# Altium project STB_LightBoard.PrjPcb (part 4 of 10)

## Sheet LED_String_NE2G757GT.SchDoc: STB Light Board - green String
size A4; Author: flmoll; DrawnBy: flmoll; Organization: PBL; Revision: A; SheetNumber: 18; SheetTotal: 20
Used 6 times, as channels LG/g_10, LG/g_11, LG/g_12, LG/g_13, LG/g_14, LG/g_15. Parts and nets are listed once, with the designators drawn on the sheet.
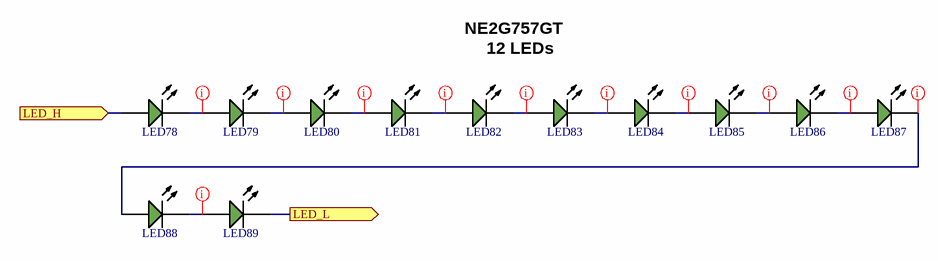
[diagram p5: LED_String_NE2G757GT.SchDoc]

### Parts
LED78  NE2G757GT  [NE2G757GT]  (value not drawn)
LED79  NE2G757GT  [NE2G757GT]  (value not drawn)
LED80  NE2G757GT  [NE2G757GT]  (value not drawn)
LED81  NE2G757GT  [NE2G757GT]  (value not drawn)
LED82  NE2G757GT  [NE2G757GT]  (value not drawn)
LED83  NE2G757GT  [NE2G757GT]  (value not drawn)
LED84  NE2G757GT  [NE2G757GT]  (value not drawn)
LED85  NE2G757GT  [NE2G757GT]  (value not drawn)
LED86  NE2G757GT  [NE2G757GT]  (value not drawn)
LED87  NE2G757GT  [NE2G757GT]  (value not drawn)
LED88  NE2G757GT  [NE2G757GT]  (value not drawn)
LED89  NE2G757GT  [NE2G757GT]  (value not drawn)

### Ports
LED_H (in, see LED_Driver_NE2G757GT[3B]), LED_L (out, see LED_Driver_NE2G757GT[3B])

### Nets
LED_H: LED78.2(A) ; port LED_H
LED_L: LED89.1(K) ; port LED_L
NetLED78_1: LED78.1(K) LED79.2(A)
NetLED79_1: LED79.1(K) LED80.2(A)
NetLED80_1: LED80.1(K) LED81.2(A)
NetLED81_1: LED81.1(K) LED82.2(A)
NetLED82_1: LED82.1(K) LED83.2(A)
NetLED83_1: LED83.1(K) LED84.2(A)
NetLED84_1: LED84.1(K) LED85.2(A)
NetLED85_1: LED85.1(K) LED86.2(A)
NetLED86_1: LED86.1(K) LED87.2(A)
NetLED87_1: LED87.1(K) LED88.2(A)
NetLED88_1: LED88.1(K) LED89.2(A)

### Channels
LG/g_10: designators end in _g_10; ports LED_H=NetC7_D26_2 LED_L=NetLED89_g_10_1
LG/g_11: designators end in _g_11; ports LED_H=NetC7_D26_2 LED_L=NetLED89_g_11_1
LG/g_12: designators end in _g_12; ports LED_H=NetC7_D26_2 LED_L=NetLED89_g_12_1
LG/g_13: designators end in _g_13; ports LED_H=NetC7_D26_2 LED_L=NetLED89_g_13_1
LG/g_14: designators end in _g_14; ports LED_H=NetC7_D26_2 LED_L=NetLED89_g_14_1
LG/g_15: designators end in _g_15; ports LED_H=NetC7_D26_2 LED_L=NetLED89_g_15_1

### Layout directives
net class LED: NetLED78_g_10_1, NetLED79_g_10_1, NetLED80_g_10_1, NetLED81_g_10_1, NetLED82_g_10_1, NetLED83_g_10_1, NetLED84_g_10_1, NetLED85_g_10_1, NetLED86_g_10_1, NetLED87_g_10_1, NetLED88_g_10_1

### Notes on the sheet
- NE2G757GT
- 12 LEDs
- 1
- 2
- 3
- 4
- A
- B
- C
- Project:
- D
- Date:
- Drawing number:
- Rev:
- Format:
- A4 Q
- Drawn by:
- Laboratory:
- Page
- Sheet:
- of
- File:

### Library data of the parts
LED78-LED89 = CMP-02061-1: SMD LED Green 3,5 V, 33 lm 3030 (1212); Manufacturer: Nichia; Optoelectronic Device Type: SINGLE COLOR LED; Vf: 3.5 V; Intensity: 33 lm; REACH SVHC: No SVHC; RoHS Compliant: Yes; Color: Green; Manufacturer Part Number: NE2G757GT

## Sheet LED_Driver_QBHP686.SchDoc: STB Light Board - 740nm
size A3; Author: mayerph; DrawnBy: mayerph; Organization: PBL; Revision: A; SheetNumber: 2; SheetTotal: 20
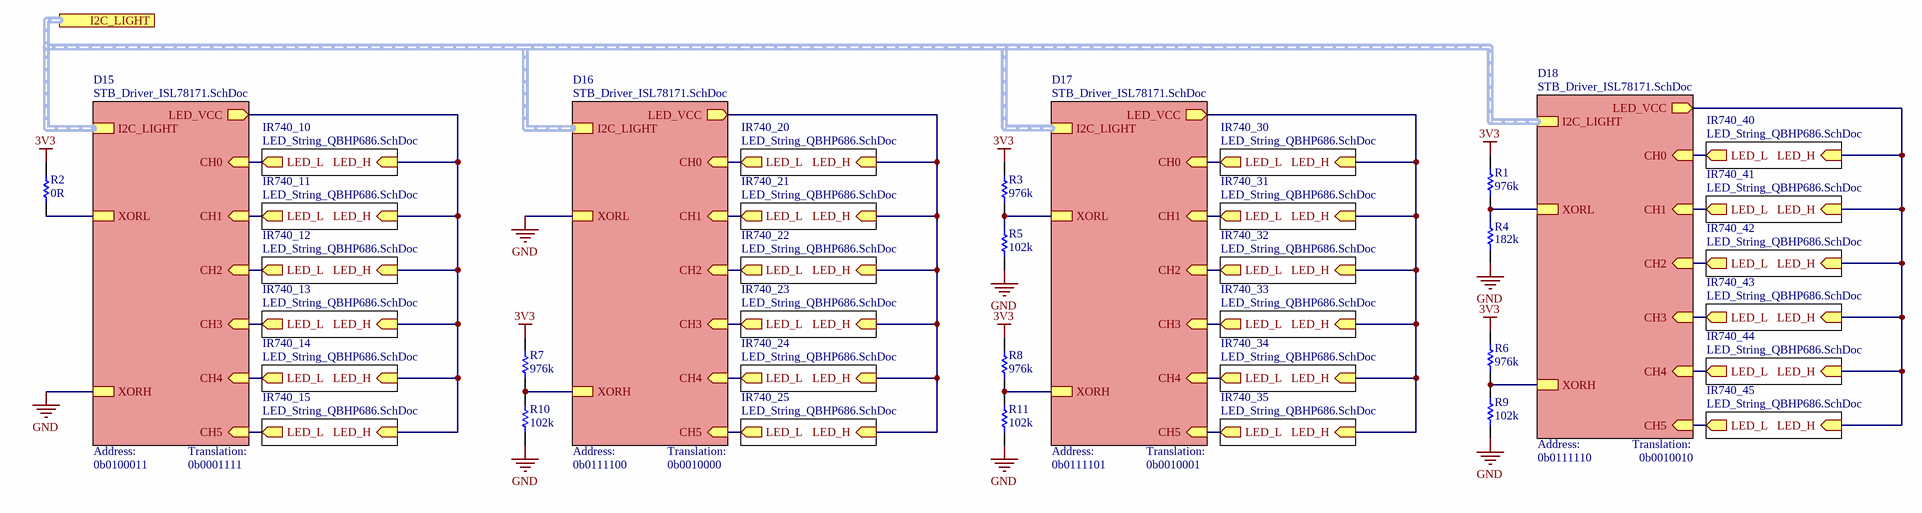
[diagram p6: LED_Driver_QBHP686.SchDoc]

### Parts
R1  976k  [RESC1005X40X25LL05T05]
R2  0R  [RESC1005X40X25LL05T10]
R3  976k  [RESC1005X40X25LL05T05]
R4  182k  [RESC1005X40X25LL05T05]
R5  102k  [RESC1005X40X25LL05T05]
R6  976k  [RESC1005X40X25LL05T05]
R7  976k  [RESC1005X40X25LL05T05]
R8  976k  [RESC1005X40X25LL05T05]
R9  102k  [RESC1005X40X25LL05T05]
R10  102k  [RESC1005X40X25LL05T05]
R11  102k  [RESC1005X40X25LL05T05]

### Sub-sheets
D15 = STB_Driver_ISL78171.SchDoc: CH0 (in), XORL, XORH, LED_VCC (out), CH1 (in), CH2 (in), CH3 (in), CH4 (in), CH5 (in), I2C_LIGHT (harness I2C_LIGHT)
D16 = STB_Driver_ISL78171.SchDoc: CH0 (in), XORL, XORH, LED_VCC (out), CH1 (in), CH2 (in), CH3 (in), CH4 (in), CH5 (in), I2C_LIGHT (harness I2C_LIGHT)
D17 = STB_Driver_ISL78171.SchDoc: CH0 (in), XORL, XORH, LED_VCC (out), CH1 (in), CH2 (in), CH3 (in), CH4 (in), CH5 (in), I2C_LIGHT (harness I2C_LIGHT)
D18 = STB_Driver_ISL78171.SchDoc: CH0 (in), XORL, XORH, LED_VCC (out), CH1 (in), CH2 (in), CH3 (in), CH4 (in), CH5 (in), I2C_LIGHT (harness I2C_LIGHT)
IR740_10 = LED_String_QBHP686.SchDoc: LED_H (in), LED_L (out)
IR740_11 = LED_String_QBHP686.SchDoc: LED_H (in), LED_L (out)
IR740_12 = LED_String_QBHP686.SchDoc: LED_H (in), LED_L (out)
IR740_13 = LED_String_QBHP686.SchDoc: LED_H (in), LED_L (out)
IR740_14 = LED_String_QBHP686.SchDoc: LED_H (in), LED_L (out)
IR740_15 = LED_String_QBHP686.SchDoc: LED_H (in), LED_L (out)
IR740_20 = LED_String_QBHP686.SchDoc: LED_H (in), LED_L (out)
IR740_21 = LED_String_QBHP686.SchDoc: LED_H (in), LED_L (out)
IR740_22 = LED_String_QBHP686.SchDoc: LED_H (in), LED_L (out)
IR740_23 = LED_String_QBHP686.SchDoc: LED_H (in), LED_L (out)
IR740_24 = LED_String_QBHP686.SchDoc: LED_H (in), LED_L (out)
IR740_25 = LED_String_QBHP686.SchDoc: LED_H (in), LED_L (out)
IR740_30 = LED_String_QBHP686.SchDoc: LED_H (in), LED_L (out)
IR740_31 = LED_String_QBHP686.SchDoc: LED_H (in), LED_L (out)
IR740_32 = LED_String_QBHP686.SchDoc: LED_H (in), LED_L (out)
IR740_33 = LED_String_QBHP686.SchDoc: LED_H (in), LED_L (out)
IR740_34 = LED_String_QBHP686.SchDoc: LED_H (in), LED_L (out)
IR740_35 = LED_String_QBHP686.SchDoc: LED_H (in), LED_L (out)
IR740_40 = LED_String_QBHP686.SchDoc: LED_H (in), LED_L (out)
IR740_41 = LED_String_QBHP686.SchDoc: LED_H (in), LED_L (out)
IR740_42 = LED_String_QBHP686.SchDoc: LED_H (in), LED_L (out)
IR740_43 = LED_String_QBHP686.SchDoc: LED_H (in), LED_L (out)
IR740_44 = LED_String_QBHP686.SchDoc: LED_H (in), LED_L (out)
IR740_45 = LED_String_QBHP686.SchDoc: LED_H (in), LED_L (out)

### Ports
I2C_LIGHT (harness I2C_LIGHT, see STB_LightBoard[4C], LED_Driver_AREM-80C0[1A], LED_Driver_AREM-90C0[1A], LED_Driver_NE2B757GT[2B], LED_Driver_NE2G757GT[2B], LED_Driver_NE2R757GT-P6[2B], LED_Driver_NF2L757GT-F1[1A], LED_Driver_NF2W757GT-F1[1A], STB_Driver_ISL78171[1A], STB_FanControl[1A], STB_UID[1A])

### Nets
3V3: R1.2 R2.2 R3.2 R6.2 R7.2 R8.2
GND: R4.1 R5.1 R9.1 R10.1 R11.1 ; sheet D15/XORH, sheet D16/XORL
NetC7_D15_2: sheet D15/LED_VCC, sheet IR740_10/LED_H, sheet IR740_11/LED_H, sheet IR740_12/LED_H, sheet IR740_13/LED_H, sheet IR740_14/LED_H, sheet IR740_15/LED_H
NetC7_D16_2: sheet D16/LED_VCC, sheet IR740_20/LED_H, sheet IR740_21/LED_H, sheet IR740_22/LED_H, sheet IR740_23/LED_H, sheet IR740_24/LED_H, sheet IR740_25/LED_H
NetC7_D17_2: sheet D17/LED_VCC, sheet IR740_30/LED_H, sheet IR740_31/LED_H, sheet IR740_32/LED_H, sheet IR740_33/LED_H, sheet IR740_34/LED_H, sheet IR740_35/LED_H
NetC7_D18_2: sheet D18/LED_VCC, sheet IR740_40/LED_H, sheet IR740_41/LED_H, sheet IR740_42/LED_H, sheet IR740_43/LED_H, sheet IR740_44/LED_H, sheet IR740_45/LED_H
NetLED64_IR740_10_1: sheet D15/CH0, sheet IR740_10/LED_L
NetLED64_IR740_11_1: sheet D15/CH1, sheet IR740_11/LED_L
NetLED64_IR740_12_1: sheet D15/CH2, sheet IR740_12/LED_L
NetLED64_IR740_13_1: sheet D15/CH3, sheet IR740_13/LED_L
NetLED64_IR740_14_1: sheet D15/CH4, sheet IR740_14/LED_L
NetLED64_IR740_15_1: sheet D15/CH5, sheet IR740_15/LED_L
NetLED64_IR740_20_1: sheet D16/CH0, sheet IR740_20/LED_L
NetLED64_IR740_21_1: sheet D16/CH1, sheet IR740_21/LED_L
NetLED64_IR740_22_1: sheet D16/CH2, sheet IR740_22/LED_L
NetLED64_IR740_23_1: sheet D16/CH3, sheet IR740_23/LED_L
NetLED64_IR740_24_1: sheet D16/CH4, sheet IR740_24/LED_L
NetLED64_IR740_25_1: sheet D16/CH5, sheet IR740_25/LED_L
NetLED64_IR740_30_1: sheet D17/CH0, sheet IR740_30/LED_L
NetLED64_IR740_31_1: sheet D17/CH1, sheet IR740_31/LED_L
NetLED64_IR740_32_1: sheet D17/CH2, sheet IR740_32/LED_L
NetLED64_IR740_33_1: sheet D17/CH3, sheet IR740_33/LED_L
NetLED64_IR740_34_1: sheet D17/CH4, sheet IR740_34/LED_L
NetLED64_IR740_35_1: sheet D17/CH5, sheet IR740_35/LED_L
NetLED64_IR740_40_1: sheet D18/CH0, sheet IR740_40/LED_L
NetLED64_IR740_41_1: sheet D18/CH1, sheet IR740_41/LED_L
NetLED64_IR740_42_1: sheet D18/CH2, sheet IR740_42/LED_L
NetLED64_IR740_43_1: sheet D18/CH3, sheet IR740_43/LED_L
NetLED64_IR740_44_1: sheet D18/CH4, sheet IR740_44/LED_L
NetLED64_IR740_45_1: sheet D18/CH5, sheet IR740_45/LED_L
NetR1_1: R1.1 R4.2 ; sheet D18/XORL
NetR2_1: R2.1 ; sheet D15/XORL
NetR3_1: R3.1 R5.2 ; sheet D17/XORL
NetR6_1: R6.1 R9.2 ; sheet D18/XORH
NetR7_1: R7.1 R10.2 ; sheet D16/XORH
NetR8_1: R8.1 R11.2 ; sheet D17/XORH

### Buses and harness runs
harness port I2C_LIGHT = sheet D15/I2C_LIGHT = sheet D16/I2C_LIGHT = sheet D17/I2C_LIGHT = sheet D18/I2C_LIGHT

### Notes on the sheet
- 0b0100011
- Address:
- Translation:
- 0b0001111
- (near R10) Address:
- 0b0111100
- 0b0010000
- (near R11) Address:
- 0b0111101
- 0b0010001
- (near R9) Address:
- 0b0111110
- 0b0010010
- 1
- 2
- 3
- 4
- 5
- 6
- 7
- 8
- A
- B
- C
- D
- Project:
- Date:
- Drawing number:
- Rev:
- Format:
- A3
- Drawn by:
- Laboratory:
- Page
- Sheet:
- of
- File:

### Library data of the parts
R1 R3 R6-R8 = CMP-2002-01120-1: as R87 on sheet LED_Driver_NE2G757GT; Supplier 1: Digi-Key; Supplier Part Number 1: P976KLCT-ND; Manufacturer Part Number: ERJ-2RKF9763X; RoHS: Yes; Category: Chip SMD Resistors; Stock 1: 136638; Pricing 1: 1=0.10000, 10=0.03300, 100=0.01330, 1000=0.00599, 2500=0.00520, 5000=0.00429 (USD); Mount: Surface Mount; Number of Pins: 2; Size Code: 0402; Terminal Finish: Nickel; Package Shape: Rectangular; Min Operating Temperature: -55°C; Max Operating Temperature: 155°C; Resistor Type: FIXED RESISTOR; Construction: Rectangular; Package Style: SMTMeter; Packaging: Tape and Reel; Termination: Wraparound; JESD-609 Code: e3; Technology: METAL GLAZE/THICK FILM; Reach SVHC Compliant: Yes; RoHS Compliant: Yes; ComponentLink1URL: https://datasheet.ciiva.com:443/pdfs/VipMasterIC/IC/PANA/PANA-S-A0009889626/PANA-S-A0009889626-1.pdf?src-supplier=IHS+Markit; ComponentLink1Description: https://datasheet.ciiva.com:443/pdfs/VipMasterIC/IC/PANA/PANA-S-A0009889626/PANA-S-A0009889626-1.pdf?src-supplier=IHS+Markit; ComponentLink2URL: https://datasheet.ciiva.com/43467/1678782-43467581.pdf?src-supplier=Farnell; ComponentLink2Description: https://datasheet.ciiva.com/43467/1678782-43467581.pdf?src-supplier=Farnell; ComponentLink3URL: https://datasheet.ciiva.com/46372/1678782-46372911.pdf?src-supplier=Element14; ComponentLink3Description: https://datasheet.ciiva.com/46372/1678782-46372911.pdf?src-supplier=Element14; ComponentLink4URL: https://datasheet.ciiva.com/22668/1678782-22668415.pdf?src-supplier=Element14; ComponentLink4Description: https://datasheet.ciiva.com/22668/1678782-22668415.pdf?src-supplier=Element14; ComponentLink5URL: https://datasheet.ciiva.com/16758/70260748-16758903.pdf?src-supplier=Allied+Electronics; ComponentLink5Description: https://datasheet.ciiva.com/16758/70260748-16758903.pdf?src-supplier=Allied+Electronics; ComponentLink6URL: https://datasheet.ciiva.com/9179/aoa0000ce2-9179357.pdf?src-supplier=Avnet; ComponentLink6Description: https://datasheet.ciiva.com/9179/aoa0000ce2-9179357.pdf?src-supplier=Avnet; ComponentLink7URL: https://datasheet.ciiva.com/30176/aoa0000ce2-30176831.pdf?src-supplier=Onlinecomponents.com; ComponentLink7Description: https://datasheet.ciiva.com/30176/aoa0000ce2-30176831.pdf?src-supplier=Onlinecomponents.com
R2 = CMP-1011-00001-2: Manufacturer: Yageo / Phycomp; Part Number: RC0402JR-070RL; Rated Power Dissipation (P): 62.5mW; Rated Temperature: 70°C; Package Height: 0.35mm; Package Length: 1mm; Package Width: 0.5mm; Supplier 1: Digi-Key; Supplier Part Number 1: 311-0.0JRDKR-ND; Manufacturer Part Number: RC0402JR-070RL; RoHS: Yes; Category: Chip SMD Resistors; Stock 1: 41330354; Pricing 1: 1=0.10000, 10=0.01200, 25=0.00840, 50=0.00640, 100=0.00480, 250=0.00364, 500=0.00290, 1000=0.00214, 5000=0.00154 (USD); Mount: Surface Mount; Number of Pins: 2; Size Code: 0402; Package Shape: Rectangular; Terminal Finish: Nickel; Min Operating Temperature: -55°C; Max Operating Temperature: 155°C; Resistor Type: FIXED RESISTOR; Resistance: 0R; Packaging: Tape and Reel; Technology: METAL GLAZE/THICK FILM; Termination: Wraparound; JESD-609 Code: e3; Construction: Chip; Package Style: SMTMeter; REACH SVHC: Yes; RoHS Compliant: Yes; ComponentLink1URL: https://datasheet.ciiva.com:443/pdfs/VipMasterIC/IC/YAGO/YAGO-S-A0008145938/YAGO-S-A0008145938-1.pdf?src-supplier=IHS+Markit; ComponentLink1Description: https://datasheet.ciiva.com:443/pdfs/VipMasterIC/IC/YAGO/YAGO-S-A0008145938/YAGO-S-A0008145938-1.pdf?src-supplier=IHS+Markit; ComponentLink2URL: https://datasheet.ciiva.com/2452/pyu-rc0402-51-rohs-l-6-2452608.pdf?src-supplier=Digi-Key; ComponentLink2Description: https://datasheet.ciiva.com/2452/pyu-rc0402-51-rohs-l-6-2452608.pdf?src-supplier=Digi-Key; ComponentLink3URL: https://datasheet.ciiva.com/11808/0900766b80c66297-11808195.pdf?src-supplier=RSComponents; ComponentLink3Description: https://datasheet.ciiva.com/11808/0900766b80c66297-11808195.pdf?src-supplier=RSComponents; ComponentLink4URL: https://datasheet.ciiva.com/7983/1018594-7983535.pdf?src-supplier=Element14; ComponentLink4Description: https://datasheet.ciiva.com/7983/1018594-7983535.pdf?src-supplier=Element14; ComponentLink5URL: https://datasheet.ciiva.com/22747/1018594-22747515.pdf?src-supplier=Element14; ComponentLink5Description: https://datasheet.ciiva.com/22747/1018594-22747515.pdf?src-supplier=Element14; ComponentLink6URL: https://datasheet.ciiva.com/2452/pyu-r-int-thick-7-2452609.pdf?src-supplier=Digi-Key; ComponentLink6Description: https://datasheet.ciiva.com/2452/pyu-r-int-thick-7-2452609.pdf?src-supplier=Digi-Key; ComponentLink7URL: https://datasheet.ciiva.com/2452/pyu-r-int-thick-7-2452610.pdf?src-supplier=Digi-Key; ComponentLink7Description: https://datasheet.ciiva.com/2452/pyu-r-int-thick-7-2452610.pdf?src-supplier=Digi-Key; ComponentLink8URL: https://datasheet.ciiva.com/8896/pyu-rc0402-51-rohs-l-6-8896201.pdf?src-supplier=Avnet; ComponentLink8Description: https://datasheet.ciiva.com/8896/pyu-rc0402-51-rohs-l-6-8896201.pdf?src-supplier=Avnet; ComponentLink9URL: https://datasheet.ciiva.com/15189/getdatasheetpartid-326379-15189533.pdf?src-supplier=Verical; ComponentLink9Description: https://datasheet.ciiva.com/15189/getdatasheetpartid-326379-15189533.pdf?src-supplier=Verical
R4 = CMP-2002-08256-1: Manufacturer: Vishay Dale; Part Number: CRCW0402182KFKED; Value: 182 kOhm; Tolerance: 1%; Rated Power Dissipation (P): 63mW; Resistance: 182kR; Temperature Coefficient: 100ppm/°C; Working Voltage: 50V; Rated Temperature: 70°C; Package Height: 0.35mm; Package Length: 1mm; Package Width: 0.5mm; Reference Standard: AEC-Q200; Supplier 1: Digi-Key; Supplier Part Number 1: 541-182KLDKR-ND; Manufacturer Part Number: CRCW0402182KFKED; RoHS: Yes; Category: Chip SMD Resistors; Stock 1: 76709; Pricing 1: 1=0.10000, 10=0.03600, 100=0.01460, 1000=0.00656, 2500=0.00569, 5000=0.00470 (USD); Mount: Surface Mount; Number of Pins: 2; Size Code: 0402; Terminal Finish: Nickel; Package Shape: Rectangular; Min Operating Temperature: -55°C; Max Operating Temperature: 155°C; JESD-609 Code: e3; Resistor Type: FIXED RESISTOR; Construction: Chip; Package Style: SMTMeter; Packaging: Tape and Reel; Technology: METAL GLAZE/THICK FILM; Termination: Wraparound; Reach SVHC Compliant: Yes; RoHS Compliant: Yes; ComponentLink1URL: https://datasheet.ciiva.com:443/pdfs/VipMasterIC/IC/VISH/VISH-S-A0007266705/VISH-S-A0007266705-1.pdf?src-supplier=IHS+Markit; ComponentLink1Description: https://datasheet.ciiva.com:443/pdfs/VipMasterIC/IC/VISH/VISH-S-A0007266705/VISH-S-A0007266705-1.pdf?src-supplier=IHS+Markit; ComponentLink2URL: https://datasheet.ciiva.com/3256/dcrcwe3-3256117.pdf?src-supplier=Avnet; ComponentLink2Description: https://datasheet.ciiva.com/3256/dcrcwe3-3256117.pdf?src-supplier=Avnet; ComponentLink3URL: https://datasheet.ciiva.com/2463/dcrcwe3-2463286.pdf?src-supplier=Digi-Key; ComponentLink3Description: https://datasheet.ciiva.com/2463/dcrcwe3-2463286.pdf?src-supplier=Digi-Key; ComponentLink4URL: https://datasheet.ciiva.com/5545/dcrcwe3-109170-5545910.pdf?src-supplier=Mouser; ComponentLink4Description: https://datasheet.ciiva.com/5545/dcrcwe3-109170-5545910.pdf?src-supplier=Mouser; ComponentLink5URL: https://datasheet.ciiva.com/2463/dcrcwe3-2463287.pdf?src-supplier=Digi-Key; ComponentLink5Description: https://datasheet.ciiva.com/2463/dcrcwe3-2463287.pdf?src-supplier=Digi-Key; ComponentLink6URL: https://datasheet.ciiva.com/7714/1697337-7714183.pdf?src-supplier=Element14; ComponentLink6Description: https://datasheet.ciiva.com/7714/1697337-7714183.pdf?src-supplier=Element14; ComponentLink7URL: https://datasheet.ciiva.com/2463/dcrcwe3-2463288.pdf?src-supplier=Digi-Key; ComponentLink7Description: https://datasheet.ciiva.com/2463/dcrcwe3-2463288.pdf?src-supplier=Digi-Key; ComponentLink8URL: https://datasheet.ciiva.com/16785/70201119-16785993.pdf?src-supplier=Allied+Electronics; ComponentLink8Description: https://datasheet.ciiva.com/16785/70201119-16785993.pdf?src-supplier=Allied+Electronics; ComponentLink9URL: https://datasheet.ciiva.com/7714/1697337-7714365.pdf?src-supplier=Element14; ComponentLink9Description: https://datasheet.ciiva.com/7714/1697337-7714365.pdf?src-supplier=Element14
R5 R9-R11 = CMP-2002-00613-1: as R88 on sheet LED_Driver_NE2G757GT; Supplier 1: Digi-Key; Supplier Part Number 1: P102KLDKR-ND; Manufacturer Part Number: ERJ-2RKF1023X; RoHS: Yes; Category: Chip SMD Resistors; Stock 1: 79400; Pricing 1: 1=0.10000, 10=0.03300, 100=0.01330, 1000=0.00599, 2500=0.00520, 5000=0.00429 (USD); Mount: Surface Mount; Number of Pins: 2; Size Code: 0402; Terminal Finish: Nickel; Package Shape: Rectangular; Min Operating Temperature: -55°C; Max Operating Temperature: 155°C; Resistor Type: FIXED RESISTOR; Construction: Rectangular; Package Style: SMTMeter; Packaging: Tape and Reel; Technology: METAL GLAZE/THICK FILM; Termination: Wraparound; JESD-609 Code: e3; Reach SVHC Compliant: Yes; RoHS Compliant: Yes; ComponentLink1URL: https://datasheet.ciiva.com:443/pdfs/VipMasterIC/IC/PANA/PANA-S-A0009889626/PANA-S-A0009889626-1.pdf?src-supplier=IHS+Markit; ComponentLink1Description: https://datasheet.ciiva.com:443/pdfs/VipMasterIC/IC/PANA/PANA-S-A0009889626/PANA-S-A0009889626-1.pdf?src-supplier=IHS+Markit; ComponentLink2URL: https://datasheet.ciiva.com/43467/1678782-43467481.pdf?src-supplier=Farnell; ComponentLink2Description: https://datasheet.ciiva.com/43467/1678782-43467481.pdf?src-supplier=Farnell; ComponentLink3URL: https://datasheet.ciiva.com/9119/aoa0000ce2-9119242.pdf?src-supplier=Avnet; ComponentLink3Description: https://datasheet.ciiva.com/9119/aoa0000ce2-9119242.pdf?src-supplier=Avnet; ComponentLink4URL: https://datasheet.ciiva.com/16781/70260748-16781503.pdf?src-supplier=Allied+Electronics; ComponentLink4Description: https://datasheet.ciiva.com/16781/70260748-16781503.pdf?src-supplier=Allied+Electronics; ComponentLink5URL: https://datasheet.ciiva.com/22673/1678782-22673487.pdf?src-supplier=Element14; ComponentLink5Description: https://datasheet.ciiva.com/22673/1678782-22673487.pdf?src-supplier=Element14; ComponentLink6URL: https://datasheet.ciiva.com/16763/70260748-16763080.pdf?src-supplier=Allied+Electronics; ComponentLink6Description: https://datasheet.ciiva.com/16763/70260748-16763080.pdf?src-supplier=Allied+Electronics; ComponentLink7URL: https://datasheet.ciiva.com/7712/1678782-7712798.pdf?src-supplier=Element14; ComponentLink7Description: https://datasheet.ciiva.com/7712/1678782-7712798.pdf?src-supplier=Element14; ComponentLink8URL: https://datasheet.ciiva.com/46373/1678782-46373215.pdf?src-supplier=Element14; ComponentLink8Description: https://datasheet.ciiva.com/46373/1678782-46373215.pdf?src-supplier=Element14

## Sheet LED_String_QBHP686.SchDoc: STB Light Board - 470nm String
size A4; Author: flmoll; DrawnBy: flmoll; Organization: PBL; Revision: A; SheetNumber: 3; SheetTotal: 20
Used 24 times, as channels LIR1/IR740_10, LIR1/IR740_11, LIR1/IR740_12, LIR1/IR740_13, LIR1/IR740_14, LIR1/IR740_15, LIR1/IR740_20, LIR1/IR740_21, LIR1/IR740_22, LIR1/IR740_23, LIR1/IR740_24, LIR1/IR740_25, LIR1/IR740_30, LIR1/IR740_31, LIR1/IR740_32, LIR1/IR740_33, LIR1/IR740_34, LIR1/IR740_35, LIR1/IR740_40, LIR1/IR740_41, LIR1/IR740_42, LIR1/IR740_43, LIR1/IR740_44, LIR1/IR740_45. Parts and nets are listed once, with the designators drawn on the sheet.
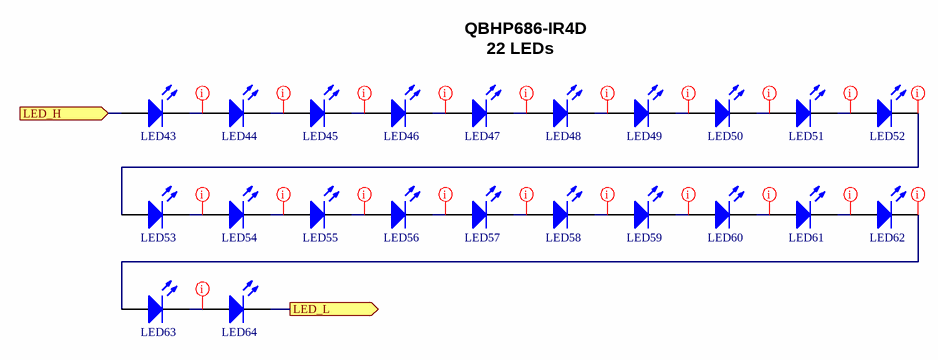
[diagram p7: LED_String_QBHP686.SchDoc]

### Parts
LED43  QBHP686-IR4D  [QBHP686-IR4D]  (value not drawn)
LED44  QBHP686-IR4D  [QBHP686-IR4D]  (value not drawn)
LED45  QBHP686-IR4D  [QBHP686-IR4D]  (value not drawn)
LED46  QBHP686-IR4D  [QBHP686-IR4D]  (value not drawn)
LED47  QBHP686-IR4D  [QBHP686-IR4D]  (value not drawn)
LED48  QBHP686-IR4D  [QBHP686-IR4D]  (value not drawn)
LED49  QBHP686-IR4D  [QBHP686-IR4D]  (value not drawn)
LED50  QBHP686-IR4D  [QBHP686-IR4D]  (value not drawn)
LED51  QBHP686-IR4D  [QBHP686-IR4D]  (value not drawn)
LED52  QBHP686-IR4D  [QBHP686-IR4D]  (value not drawn)
LED53  QBHP686-IR4D  [QBHP686-IR4D]  (value not drawn)
LED54  QBHP686-IR4D  [QBHP686-IR4D]  (value not drawn)
LED55  QBHP686-IR4D  [QBHP686-IR4D]  (value not drawn)
LED56  QBHP686-IR4D  [QBHP686-IR4D]  (value not drawn)
LED57  QBHP686-IR4D  [QBHP686-IR4D]  (value not drawn)
LED58  QBHP686-IR4D  [QBHP686-IR4D]  (value not drawn)
LED59  QBHP686-IR4D  [QBHP686-IR4D]  (value not drawn)
LED60  QBHP686-IR4D  [QBHP686-IR4D]  (value not drawn)
LED61  QBHP686-IR4D  [QBHP686-IR4D]  (value not drawn)
LED62  QBHP686-IR4D  [QBHP686-IR4D]  (value not drawn)
LED63  QBHP686-IR4D  [QBHP686-IR4D]  (value not drawn)
LED64  QBHP686-IR4D  [QBHP686-IR4D]  (value not drawn)

### Ports
LED_H (in, see LED_Driver_QBHP686[2A]), LED_L (out, see LED_Driver_QBHP686[2A])

### Nets
LED_H: LED43.2(A) ; port LED_H
LED_L: LED64.1(K) ; port LED_L
NetLED43_1: LED43.1(K) LED44.2(A)
NetLED44_1: LED44.1(K) LED45.2(A)
NetLED45_1: LED45.1(K) LED46.2(A)
NetLED46_1: LED46.1(K) LED47.2(A)
NetLED47_1: LED47.1(K) LED48.2(A)
NetLED48_1: LED48.1(K) LED49.2(A)
NetLED49_1: LED49.1(K) LED50.2(A)
NetLED50_1: LED50.1(K) LED51.2(A)
NetLED51_1: LED51.1(K) LED52.2(A)
NetLED52_1: LED52.1(K) LED53.2(A)
NetLED53_1: LED53.1(K) LED54.2(A)
NetLED54_1: LED54.1(K) LED55.2(A)
NetLED55_1: LED55.1(K) LED56.2(A)
NetLED56_1: LED56.1(K) LED57.2(A)
NetLED57_1: LED57.1(K) LED58.2(A)
NetLED58_1: LED58.1(K) LED59.2(A)
NetLED59_1: LED59.1(K) LED60.2(A)
NetLED60_1: LED60.1(K) LED61.2(A)
NetLED61_1: LED61.1(K) LED62.2(A)
NetLED62_1: LED62.1(K) LED63.2(A)
NetLED63_1: LED63.1(K) LED64.2(A)

### Channels
LIR1/IR740_10: designators end in _IR740_10; ports LED_H=NetC7_D15_2 LED_L=NetLED64_IR740_10_1
LIR1/IR740_11: designators end in _IR740_11; ports LED_H=NetC7_D15_2 LED_L=NetLED64_IR740_11_1
LIR1/IR740_12: designators end in _IR740_12; ports LED_H=NetC7_D15_2 LED_L=NetLED64_IR740_12_1
LIR1/IR740_13: designators end in _IR740_13; ports LED_H=NetC7_D15_2 LED_L=NetLED64_IR740_13_1
LIR1/IR740_14: designators end in _IR740_14; ports LED_H=NetC7_D15_2 LED_L=NetLED64_IR740_14_1
LIR1/IR740_15: designators end in _IR740_15; ports LED_H=NetC7_D15_2 LED_L=NetLED64_IR740_15_1
LIR1/IR740_20: designators end in _IR740_20; ports LED_H=NetC7_D16_2 LED_L=NetLED64_IR740_20_1
LIR1/IR740_21: designators end in _IR740_21; ports LED_H=NetC7_D16_2 LED_L=NetLED64_IR740_21_1
LIR1/IR740_22: designators end in _IR740_22; ports LED_H=NetC7_D16_2 LED_L=NetLED64_IR740_22_1
LIR1/IR740_23: designators end in _IR740_23; ports LED_H=NetC7_D16_2 LED_L=NetLED64_IR740_23_1
LIR1/IR740_24: designators end in _IR740_24; ports LED_H=NetC7_D16_2 LED_L=NetLED64_IR740_24_1
LIR1/IR740_25: designators end in _IR740_25; ports LED_H=NetC7_D16_2 LED_L=NetLED64_IR740_25_1
LIR1/IR740_30: designators end in _IR740_30; ports LED_H=NetC7_D17_2 LED_L=NetLED64_IR740_30_1
LIR1/IR740_31: designators end in _IR740_31; ports LED_H=NetC7_D17_2 LED_L=NetLED64_IR740_31_1
LIR1/IR740_32: designators end in _IR740_32; ports LED_H=NetC7_D17_2 LED_L=NetLED64_IR740_32_1
LIR1/IR740_33: designators end in _IR740_33; ports LED_H=NetC7_D17_2 LED_L=NetLED64_IR740_33_1
LIR1/IR740_34: designators end in _IR740_34; ports LED_H=NetC7_D17_2 LED_L=NetLED64_IR740_34_1
LIR1/IR740_35: designators end in _IR740_35; ports LED_H=NetC7_D17_2 LED_L=NetLED64_IR740_35_1
LIR1/IR740_40: designators end in _IR740_40; ports LED_H=NetC7_D18_2 LED_L=NetLED64_IR740_40_1
LIR1/IR740_41: designators end in _IR740_41; ports LED_H=NetC7_D18_2 LED_L=NetLED64_IR740_41_1
LIR1/IR740_42: designators end in _IR740_42; ports LED_H=NetC7_D18_2 LED_L=NetLED64_IR740_42_1
LIR1/IR740_43: designators end in _IR740_43; ports LED_H=NetC7_D18_2 LED_L=NetLED64_IR740_43_1
LIR1/IR740_44: designators end in _IR740_44; ports LED_H=NetC7_D18_2 LED_L=NetLED64_IR740_44_1
LIR1/IR740_45: designators end in _IR740_45; ports LED_H=NetC7_D18_2 LED_L=NetLED64_IR740_45_1

### Layout directives
net class LED: NetLED43_IR740_10_1, NetLED44_IR740_10_1, NetLED45_IR740_10_1, NetLED46_IR740_10_1, NetLED47_IR740_10_1, NetLED48_IR740_10_1, NetLED49_IR740_10_1, NetLED50_IR740_10_1, NetLED51_IR740_10_1, NetLED52_IR740_10_1, NetLED53_IR740_10_1, NetLED54_IR740_10_1, NetLED55_IR740_10_1, NetLED56_IR740_10_1, NetLED57_IR740_10_1, NetLED58_IR740_10_1, NetLED59_IR740_10_1, NetLED60_IR740_10_1, NetLED61_IR740_10_1, NetLED62_IR740_10_1, NetLED63_IR740_10_1

### Notes on the sheet
- QBHP686-IR4D
- 22 LEDs
- 1
- 2
- 3
- 4
- A
- B
- C
- Project:
- D
- Date:
- Drawing number:
- Rev:
- Format:
- A4 Q
- Drawn by:
- Laboratory:
- Page
- Sheet:
- of
- File:

### Library data of the parts
LED43-LED64 = CMP-02055-1: Infrared (IR) Emitter 740nm 1.8V 100mA 5.6mW/sr @ 50mA 120° 1411 (3528 Metric); Mfr: QT Brightek (QTB); Manufacturer: QT-Brightek; Series: Mid Power; Type: Infrared (IR); Current - DC Forward (If) (Max): 100mA; Radiant Intensity (Ie) Min @ If: 5.6mW/sr @ 50mA; Wavelength: 740nm; Voltage - Forward (Vf) (Typ): 1.8V; Viewing Angle: 120°; Orientation: Top View; Operating Temperature: -40°C ~ 80°C; Mounting Type: Surface Mount; Package / Case: 1411 (3528 Metric); Base Product Number: QBHP686; Supplier 1: Digi-Key; Supplier Part Number 1: 1516-QBHP686-IR4DCT-ND; Manufacturer Part Number: QBHP686-IR4D; RoHS: No; Stock 1: 1500; Pricing 1: 1=0.92000, 10=0.60000, 100=0.39330, 1000=0.31050 (USD)

## Sheet LED_Driver_AREM-80C0.SchDoc: STB Light Board - 850nm
size A4; Author: flmoll; DrawnBy: flmoll; Organization: PBL; Revision: A; SheetNumber: 13; SheetTotal: 20
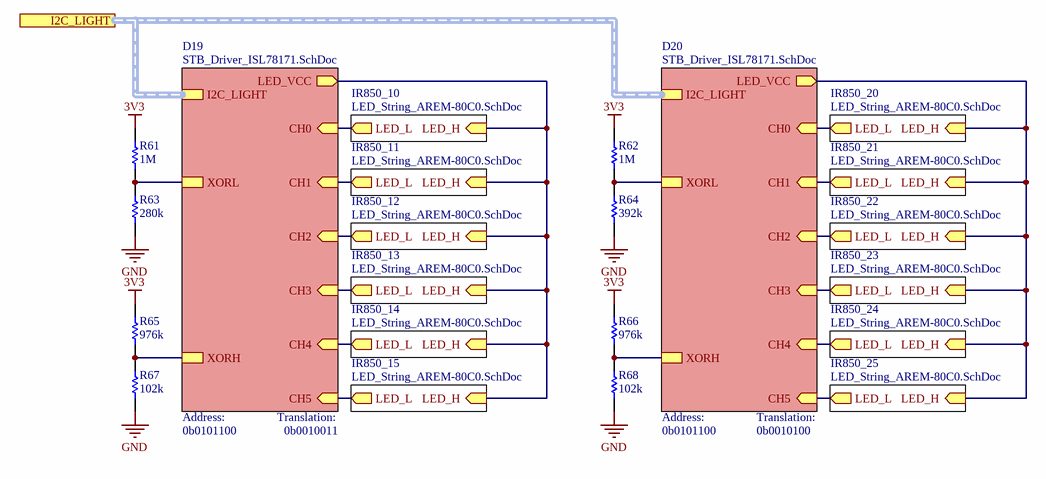
[diagram p8: LED_Driver_AREM-80C0.SchDoc]

### Parts
R61  1M  [RESC1005X40X25LL05T05]
R62  1M  [RESC1005X40X25LL05T05]
R63  280k  [RESC1005X40X25LL05T05]
R64  392k  [RESC1005X40X25LL05T05]
R65  976k  [RESC1005X40X25LL05T05]
R66  976k  [RESC1005X40X25LL05T05]
R67  102k  [RESC1005X40X25LL05T05]
R68  102k  [RESC1005X40X25LL05T05]

### Sub-sheets
D19 = STB_Driver_ISL78171.SchDoc: CH0 (in), XORL, XORH, LED_VCC (out), CH1 (in), CH2 (in), CH3 (in), CH4 (in), CH5 (in), I2C_LIGHT (harness I2C_LIGHT)
D20 = STB_Driver_ISL78171.SchDoc: CH0 (in), XORL, XORH, LED_VCC (out), CH1 (in), CH2 (in), CH3 (in), CH4 (in), CH5 (in), I2C_LIGHT (harness I2C_LIGHT)
IR850_10 = LED_String_AREM-80C0.SchDoc: LED_H (in), LED_L (out)
IR850_11 = LED_String_AREM-80C0.SchDoc: LED_H (in), LED_L (out)
IR850_12 = LED_String_AREM-80C0.SchDoc: LED_H (in), LED_L (out)
IR850_13 = LED_String_AREM-80C0.SchDoc: LED_H (in), LED_L (out)
IR850_14 = LED_String_AREM-80C0.SchDoc: LED_H (in), LED_L (out)
IR850_15 = LED_String_AREM-80C0.SchDoc: LED_H (in), LED_L (out)
IR850_20 = LED_String_AREM-80C0.SchDoc: LED_H (in), LED_L (out)
IR850_21 = LED_String_AREM-80C0.SchDoc: LED_H (in), LED_L (out)
IR850_22 = LED_String_AREM-80C0.SchDoc: LED_H (in), LED_L (out)
IR850_23 = LED_String_AREM-80C0.SchDoc: LED_H (in), LED_L (out)
IR850_24 = LED_String_AREM-80C0.SchDoc: LED_H (in), LED_L (out)
IR850_25 = LED_String_AREM-80C0.SchDoc: LED_H (in), LED_L (out)

### Ports
I2C_LIGHT (harness I2C_LIGHT, see STB_LightBoard[4C], LED_Driver_AREM-90C0[1A], LED_Driver_NE2B757GT[2B], LED_Driver_NE2G757GT[2B], LED_Driver_NE2R757GT-P6[2B], LED_Driver_NF2L757GT-F1[1A], LED_Driver_NF2W757GT-F1[1A], LED_Driver_QBHP686[1A], STB_Driver_ISL78171[1A], STB_FanControl[1A], STB_UID[1A])

### Nets
3V3: R61.2 R62.2 R65.2 R66.2
GND: R63.1 R64.1 R67.1 R68.1
NetC7_D19_2: sheet D19/LED_VCC, sheet IR850_10/LED_H, sheet IR850_11/LED_H, sheet IR850_12/LED_H, sheet IR850_13/LED_H, sheet IR850_14/LED_H, sheet IR850_15/LED_H
NetC7_D20_2: sheet D20/LED_VCC, sheet IR850_20/LED_H, sheet IR850_21/LED_H, sheet IR850_22/LED_H, sheet IR850_23/LED_H, sheet IR850_24/LED_H, sheet IR850_25/LED_H
NetLED129_IR850_10_1: sheet D19/CH0, sheet IR850_10/LED_L
NetLED129_IR850_11_1: sheet D19/CH1, sheet IR850_11/LED_L
NetLED129_IR850_12_1: sheet D19/CH2, sheet IR850_12/LED_L
NetLED129_IR850_13_1: sheet D19/CH3, sheet IR850_13/LED_L
NetLED129_IR850_14_1: sheet D19/CH4, sheet IR850_14/LED_L
NetLED129_IR850_15_1: sheet D19/CH5, sheet IR850_15/LED_L
NetLED129_IR850_20_1: sheet D20/CH0, sheet IR850_20/LED_L
NetLED129_IR850_21_1: sheet D20/CH1, sheet IR850_21/LED_L
NetLED129_IR850_22_1: sheet D20/CH2, sheet IR850_22/LED_L
NetLED129_IR850_23_1: sheet D20/CH3, sheet IR850_23/LED_L
NetLED129_IR850_24_1: sheet D20/CH4, sheet IR850_24/LED_L
NetLED129_IR850_25_1: sheet D20/CH5, sheet IR850_25/LED_L
NetR61_1: R61.1 R63.2 ; sheet D19/XORL
NetR62_1: R62.1 R64.2 ; sheet D20/XORL
NetR65_1: R65.1 R67.2 ; sheet D19/XORH
NetR66_1: R66.1 R68.2 ; sheet D20/XORH

### Buses and harness runs
harness port I2C_LIGHT = sheet D19/I2C_LIGHT = sheet D20/I2C_LIGHT

### Notes on the sheet
- (near R67) Address:
- 0b0101100
- Translation:
- 0b0010011
- (near R68) Address:
- 0b0010100
- 1
- 2
- 3
- 4
- A
- B
- C
- Project:
- D
- Date:
- Drawing number:
- Rev:
- Format:
- A4 Q
- Drawn by:
- Laboratory:
- Page
- Sheet:
- of
- File:

### Library data of the parts
R61 R62 = CMP-2002-00609-3: Chip Resistor, 1 MOhm, +/- 1%, 100 mW, -55 to 155 degC, 0402 (1005 Metric), RoHS, Tape and Reel; PartNumber: ERJ-2RKF1004X; Manufacturer: Basic Passives; Voltage Rating: 50 V; Case\/Package: 0402; Value: 1 MOhm; Power Rating: 100 mW; Rated Power Dissipation (P): 100mW; Temperature Coefficient: 100ppm/°C; Working Voltage: 50V; Rated Temperature: 70°C; Package Height: 0.35mm; Package Length: 1mm; Package Width: 0.5mm; Reference Standard: AEC-Q200; Pins: 2; Max Operating Temperature: 155 degC; ComponentLink2URL: http://industrial.panasonic.com/cdbs/www-data/pdf/RDA0000/AOA0000C86.pdf; Weight: 2.8E-05oz; ComponentLink1URL: http://www.panasonic.com/; Radiation Hardening: No; Height: 0.35 mm; Case Code (Imperial): 0402; ComponentLink2Description: Datasheet; Mount: Surface Mount; ComponentLink1Description: Manufacturer URL; REACH SVHC: Yes; Length: 1 mm; Min Operating Temperature: -55 degC; Width: 0.5 mm; Package Quantity: 10000; Tolerance: 1%; PackageDescription: 2-Pin Surface Mount Device, Body 1 x 0.5 mm; RoHSCompliant: true; DatasheetVersion: 04/2015; PackageReference: 0402; Mounting Technology: Surface Mount; Case Code (Metric): 1005; Packaging: Tape and Reel; Supplier 1: Digi-Key; Supplier Part Number 1: P1.00MLDKR-ND; Manufacturer Part Number: ERJ-2RKF1004X; RoHS: Yes; Category: Chip SMD Resistors; Stock 1: 1012879; Pricing 1: 1=0.10000, 10=0.03300, 100=0.01330, 1000=0.00599, 2500=0.00520, 5000=0.00429 (USD); Number of Pins: 2; Package Shape: Rectangular; Size Code: 0402; Terminal Finish: Nickel; JESD-609 Code: e3; Resistor Type: FIXED RESISTOR; Construction: Rectangular; Package Style: SMTMeter; Technology: METAL GLAZE/THICK FILM; Termination: Wraparound; Reach SVHC Compliant: Yes; RoHS Compliant: Yes; ComponentLink3URL: https://datasheet.ciiva.com:443/pdfs/VipMasterIC/IC/PANA/PANA-S-A0009889626/PANA-S-A0009889626-1.pdf?src-supplier=IHS+Markit; ComponentLink3Description: https://datasheet.ciiva.com:443/pdfs/VipMasterIC/IC/PANA/PANA-S-A0009889626/PANA-S-A0009889626-1.pdf?src-supplier=IHS+Markit; ComponentLink4URL: https://datasheet.ciiva.com/34303/1987046-34303551.pdf?src-supplier=Jameco; ComponentLink4Description: https://datasheet.ciiva.com/34303/1987046-34303551.pdf?src-supplier=Jameco; ComponentLink5URL: https://datasheet.ciiva.com/11821/0900766b80f80784-11821229.pdf?src-supplier=RSComponents; ComponentLink5Description: https://datasheet.ciiva.com/11821/0900766b80f80784-11821229.pdf?src-supplier=RSComponents; ComponentLink6URL: https://datasheet.ciiva.com/7909/aoa0000ce2-7909180.pdf?src-supplier=Element14; ComponentLink6Description: https://datasheet.ciiva.com/7909/aoa0000ce2-7909180.pdf?src-supplier=Element14; ComponentLink7URL: https://datasheet.ciiva.com/22723/1678782-22723164.pdf?src-supplier=Element14; ComponentLink7Description: https://datasheet.ciiva.com/22723/1678782-22723164.pdf?src-supplier=Element14; ComponentLink8URL: https://datasheet.ciiva.com/24158/aoa0000ce2-24158990.pdf?src-supplier=Mouser; ComponentLink8Description: https://datasheet.ciiva.com/24158/aoa0000ce2-24158990.pdf?src-supplier=Mouser; ComponentLink9URL: https://datasheet.ciiva.com/16766/70260748-16766711.pdf?src-supplier=Allied+Electronics; ComponentLink9Description: https://datasheet.ciiva.com/16766/70260748-16766711.pdf?src-supplier=Allied+Electronics; ComponentLink10URL: https://datasheet.ciiva.com/16779/70260748-16779288.pdf?src-supplier=Allied+Electronics; ComponentLink10Description: https://datasheet.ciiva.com/16779/70260748-16779288.pdf?src-supplier=Allied+Electronics; ComponentLink11URL: https://datasheet.ciiva.com/16199/aoa0000ce2-16199544.pdf?src-supplier=Future+Electronics; ComponentLink11Description: https://datasheet.ciiva.com/16199/aoa0000ce2-16199544.pdf?src-supplier=Future+Electronics
R63 = CMP-1011-00785-4: Chip Resistor, 280 KOhm, +/- 1%, 100 mW, -55 to 155 degC, 0402 (1005 Metric), RoHS, Cut Tape; PartNumber: ERJ-2RKF2803X; Manufacturer: Basic Passives; Power Rating: 100 mW; Case\/Package: 0402; Voltage Rating: 50 V; Rated Power Dissipation (P): 100mW; Rated Temperature: 70°C; Temperature Coefficient: 100ppm/°C; Working Voltage: 50V; Package Height: 0.35mm; Package Length: 1mm; Package Width: 0.5mm; Reference Standard: AEC-Q200; Value: 280 kOhm; Width: 0.02 inch; Packaging: Cut Tape; Min Operating Temperature: -55 degC; Package Quantity: 10000; Height: 0.016 inch; ComponentLink2Description: Datasheet; REACH SVHC: Yes; Length: 0.039 inch; Mounting Technology: Surface Mount; Mount: Surface Mount; ComponentLink1Description: Manufacturer URL; PackageDescription: 2-Pin Surface Mount Device, Body 1 x 0.5 mm; PackageReference: 0402; Case Code (Metric): 1005; ComponentLink2URL: http://industrial.panasonic.com/cdbs/www-data/pdf/RDA0000/AOA0000C86.pdf; Pins: 2; DatasheetVersion: 04/2015; ComponentLink1URL: http://www.panasonic.com/; RoHSCompliant: true; Case Code (Imperial): 0402; Tolerance: 1%; Max Operating Temperature: 155 degC; Supplier 1: Digi-Key; Supplier Part Number 1: P280KLDKR-ND; Manufacturer Part Number: ERJ-2RKF2803X; RoHS: Yes; Category: Chip SMD Resistors; Stock 1: 156859; Pricing 1: 1=0.10000, 10=0.03300, 100=0.01330, 1000=0.00599, 2500=0.00520, 5000=0.00429 (USD); Number of Pins: 2; Size Code: 0402; Terminal Finish: Nickel; Package Shape: Rectangular; Resistor Type: FIXED RESISTOR; Termination: Wraparound; JESD-609 Code: e3; Construction: Rectangular; Package Style: SMTMeter; Technology: METAL GLAZE/THICK FILM; Reach SVHC Compliant: Yes; RoHS Compliant: Yes; ComponentLink3URL: https://datasheet.ciiva.com:443/pdfs/VipMasterIC/IC/PANA/PANA-S-A0009889626/PANA-S-A0009889626-1.pdf?src-supplier=IHS+Markit; ComponentLink3Description: https://datasheet.ciiva.com:443/pdfs/VipMasterIC/IC/PANA/PANA-S-A0009889626/PANA-S-A0009889626-1.pdf?src-supplier=IHS+Markit; ComponentLink4URL: https://datasheet.ciiva.com/9183/aoa0000ce2-9183500.pdf?src-supplier=Avnet; ComponentLink4Description: https://datasheet.ciiva.com/9183/aoa0000ce2-9183500.pdf?src-supplier=Avnet; ComponentLink5URL: https://datasheet.ciiva.com/28594/1694929-28594570.pdf?src-supplier=Element14; ComponentLink5Description: https://datasheet.ciiva.com/28594/1694929-28594570.pdf?src-supplier=Element14; ComponentLink6URL: https://datasheet.ciiva.com/24024/aoa0000ce2-24024731.pdf?src-supplier=Mouser; ComponentLink6Description: https://datasheet.ciiva.com/24024/aoa0000ce2-24024731.pdf?src-supplier=Mouser; ComponentLink7URL: https://datasheet.ciiva.com/30177/aoa0000ce2-30177532.pdf?src-supplier=Onlinecomponents.com; ComponentLink7Description: https://datasheet.ciiva.com/30177/aoa0000ce2-30177532.pdf?src-supplier=Onlinecomponents.com; ComponentLink8URL: https://datasheet.ciiva.com/7712/1678782-7712815.pdf?src-supplier=Element14; ComponentLink8Description: https://datasheet.ciiva.com/7712/1678782-7712815.pdf?src-supplier=Element14
R64 = CMP-2002-00914-1: Part Number: ERJ-2RKF3923X; Manufacturer: Panasonic; Tolerance: 1%; Rated Power Dissipation (P): 100mW; Rated Temperature: 70°C; Value: 392 kOhm; Temperature Coefficient: 100ppm/°C; Working Voltage: 50V; Package Height: 0.35mm; Package Length: 1mm; Package Width: 0.5mm; Reference Standard: AEC-Q200; Supplier 1: Digi-Key; Supplier Part Number 1: P392KLDKR-ND; Manufacturer Part Number: ERJ-2RKF3923X; RoHS: Yes; Category: Chip SMD Resistors; Stock 1: 100496; Pricing 1: 1=0.10000, 10=0.03300, 100=0.01330, 1000=0.00599, 2500=0.00520, 5000=0.00429 (USD); Mount: Surface Mount; Number of Pins: 2; Size Code: 0402; Terminal Finish: Nickel; Package Shape: Rectangular; Min Operating Temperature: -55°C; Max Operating Temperature: 155°C; JESD-609 Code: e3; Resistor Type: FIXED RESISTOR; Construction: Rectangular; Package Style: SMTMeter; Packaging: Tape and Reel; Technology: METAL GLAZE/THICK FILM; Termination: Wraparound; Reach SVHC Compliant: Yes; RoHS Compliant: Yes; ComponentLink1URL: https://datasheet.ciiva.com:443/pdfs/VipMasterIC/IC/PANA/PANA-S-A0009889626/PANA-S-A0009889626-1.pdf?src-supplier=IHS+Markit; ComponentLink1Description: https://datasheet.ciiva.com:443/pdfs/VipMasterIC/IC/PANA/PANA-S-A0009889626/PANA-S-A0009889626-1.pdf?src-supplier=IHS+Markit; ComponentLink2URL: https://datasheet.ciiva.com/24069/aoa0000ce2-24069223.pdf?src-supplier=Mouser; ComponentLink2Description: https://datasheet.ciiva.com/24069/aoa0000ce2-24069223.pdf?src-supplier=Mouser; ComponentLink3URL: https://datasheet.ciiva.com/30085/aoa0000ce2-30085781.pdf?src-supplier=Onlinecomponents.com; ComponentLink3Description: https://datasheet.ciiva.com/30085/aoa0000ce2-30085781.pdf?src-supplier=Onlinecomponents.com; ComponentLink4URL: https://datasheet.ciiva.com/16781/70260748-16781463.pdf?src-supplier=Allied+Electronics; ComponentLink4Description: https://datasheet.ciiva.com/16781/70260748-16781463.pdf?src-supplier=Allied+Electronics; ComponentLink5URL: https://datasheet.ciiva.com/22673/1678782-22673356.pdf?src-supplier=Element14; ComponentLink5Description: https://datasheet.ciiva.com/22673/1678782-22673356.pdf?src-supplier=Element14; ComponentLink6URL: https://datasheet.ciiva.com/46399/1678782-46399980.pdf?src-supplier=Element14; ComponentLink6Description: https://datasheet.ciiva.com/46399/1678782-46399980.pdf?src-supplier=Element14; ComponentLink7URL: https://datasheet.ciiva.com/46399/1678782-46399981.pdf?src-supplier=Element14; ComponentLink7Description: https://datasheet.ciiva.com/46399/1678782-46399981.pdf?src-supplier=Element14; ComponentLink8URL: https://datasheet.ciiva.com/22776/1678782-22776542.pdf?src-supplier=Farnell; ComponentLink8Description: https://datasheet.ciiva.com/22776/1678782-22776542.pdf?src-supplier=Farnell; ComponentLink9URL: https://datasheet.ciiva.com/16774/70260748-16774815.pdf?src-supplier=Allied+Electronics; ComponentLink9Description: https://datasheet.ciiva.com/16774/70260748-16774815.pdf?src-supplier=Allied+Electronics
R65 R66 = CMP-2002-01120-1: Manufacturer: Panasonic; Part Number: ERJ-2RKF9763X; Tolerance: 1%; Rated Power Dissipation (P): 100mW; Rated Temperature: 70°C; Value: 976 kOhm; Temperature Coefficient: 100ppm/°C; Working Voltage: 50V; Package Height: 0.35mm; Package Length: 1mm; Package Width: 0.5mm; Reference Standard: AEC-Q200; Supplier 1: Digi-Key; Supplier Part Number 1: P976KLCT-ND; Manufacturer Part Number: ERJ-2RKF9763X; RoHS: Yes; Category: Chip SMD Resistors; Stock 1: 136638; Pricing 1: 1=0.10000, 10=0.03300, 100=0.01330, 1000=0.00599, 2500=0.00520, 5000=0.00429 (USD); Mount: Surface Mount; Number of Pins: 2; Size Code: 0402; Terminal Finish: Nickel; Package Shape: Rectangular; Min Operating Temperature: -55°C; Max Operating Temperature: 155°C; Resistor Type: FIXED RESISTOR; Construction: Rectangular; Package Style: SMTMeter; Packaging: Tape and Reel; Termination: Wraparound; JESD-609 Code: e3; Technology: METAL GLAZE/THICK FILM; Reach SVHC Compliant: Yes; RoHS Compliant: Yes; ComponentLink1URL: https://datasheet.ciiva.com:443/pdfs/VipMasterIC/IC/PANA/PANA-S-A0009889626/PANA-S-A0009889626-1.pdf?src-supplier=IHS+Markit; ComponentLink1Description: https://datasheet.ciiva.com:443/pdfs/VipMasterIC/IC/PANA/PANA-S-A0009889626/PANA-S-A0009889626-1.pdf?src-supplier=IHS+Markit; ComponentLink2URL: https://datasheet.ciiva.com/43467/1678782-43467581.pdf?src-supplier=Farnell; ComponentLink2Description: https://datasheet.ciiva.com/43467/1678782-43467581.pdf?src-supplier=Farnell; ComponentLink3URL: https://datasheet.ciiva.com/46372/1678782-46372911.pdf?src-supplier=Element14; ComponentLink3Description: https://datasheet.ciiva.com/46372/1678782-46372911.pdf?src-supplier=Element14; ComponentLink4URL: https://datasheet.ciiva.com/22668/1678782-22668415.pdf?src-supplier=Element14; ComponentLink4Description: https://datasheet.ciiva.com/22668/1678782-22668415.pdf?src-supplier=Element14; ComponentLink5URL: https://datasheet.ciiva.com/16758/70260748-16758903.pdf?src-supplier=Allied+Electronics; ComponentLink5Description: https://datasheet.ciiva.com/16758/70260748-16758903.pdf?src-supplier=Allied+Electronics; ComponentLink6URL: https://datasheet.ciiva.com/9179/aoa0000ce2-9179357.pdf?src-supplier=Avnet; ComponentLink6Description: https://datasheet.ciiva.com/9179/aoa0000ce2-9179357.pdf?src-supplier=Avnet; ComponentLink7URL: https://datasheet.ciiva.com/30176/aoa0000ce2-30176831.pdf?src-supplier=Onlinecomponents.com; ComponentLink7Description: https://datasheet.ciiva.com/30176/aoa0000ce2-30176831.pdf?src-supplier=Onlinecomponents.com
R67 R68 = CMP-2002-00613-1: Manufacturer: Panasonic; Part Number: ERJ-2RKF1023X; Tolerance: 1%; Rated Power Dissipation (P): 100mW; Rated Temperature: 70°C; Value: 102 kOhm; Temperature Coefficient: 100ppm/°C; Working Voltage: 50V; Package Height: 0.35mm; Package Length: 1mm; Package Width: 0.5mm; Reference Standard: AEC-Q200; Supplier 1: Digi-Key; Supplier Part Number 1: P102KLDKR-ND; Manufacturer Part Number: ERJ-2RKF1023X; RoHS: Yes; Category: Chip SMD Resistors; Stock 1: 79400; Pricing 1: 1=0.10000, 10=0.03300, 100=0.01330, 1000=0.00599, 2500=0.00520, 5000=0.00429 (USD); Mount: Surface Mount; Number of Pins: 2; Size Code: 0402; Terminal Finish: Nickel; Package Shape: Rectangular; Min Operating Temperature: -55°C; Max Operating Temperature: 155°C; Resistor Type: FIXED RESISTOR; Construction: Rectangular; Package Style: SMTMeter; Packaging: Tape and Reel; Technology: METAL GLAZE/THICK FILM; Termination: Wraparound; JESD-609 Code: e3; Reach SVHC Compliant: Yes; RoHS Compliant: Yes; ComponentLink1URL: https://datasheet.ciiva.com:443/pdfs/VipMasterIC/IC/PANA/PANA-S-A0009889626/PANA-S-A0009889626-1.pdf?src-supplier=IHS+Markit; ComponentLink1Description: https://datasheet.ciiva.com:443/pdfs/VipMasterIC/IC/PANA/PANA-S-A0009889626/PANA-S-A0009889626-1.pdf?src-supplier=IHS+Markit; ComponentLink2URL: https://datasheet.ciiva.com/43467/1678782-43467481.pdf?src-supplier=Farnell; ComponentLink2Description: https://datasheet.ciiva.com/43467/1678782-43467481.pdf?src-supplier=Farnell; ComponentLink3URL: https://datasheet.ciiva.com/9119/aoa0000ce2-9119242.pdf?src-supplier=Avnet; ComponentLink3Description: https://datasheet.ciiva.com/9119/aoa0000ce2-9119242.pdf?src-supplier=Avnet; ComponentLink4URL: https://datasheet.ciiva.com/16781/70260748-16781503.pdf?src-supplier=Allied+Electronics; ComponentLink4Description: https://datasheet.ciiva.com/16781/70260748-16781503.pdf?src-supplier=Allied+Electronics; ComponentLink5URL: https://datasheet.ciiva.com/22673/1678782-22673487.pdf?src-supplier=Element14; ComponentLink5Description: https://datasheet.ciiva.com/22673/1678782-22673487.pdf?src-supplier=Element14; ComponentLink6URL: https://datasheet.ciiva.com/16763/70260748-16763080.pdf?src-supplier=Allied+Electronics; ComponentLink6Description: https://datasheet.ciiva.com/16763/70260748-16763080.pdf?src-supplier=Allied+Electronics; ComponentLink7URL: https://datasheet.ciiva.com/7712/1678782-7712798.pdf?src-supplier=Element14; ComponentLink7Description: https://datasheet.ciiva.com/7712/1678782-7712798.pdf?src-supplier=Element14; ComponentLink8URL: https://datasheet.ciiva.com/46373/1678782-46373215.pdf?src-supplier=Element14; ComponentLink8Description: https://datasheet.ciiva.com/46373/1678782-46373215.pdf?src-supplier=Element14